# EAGLE design hitter (EAGLE 9.6.2)
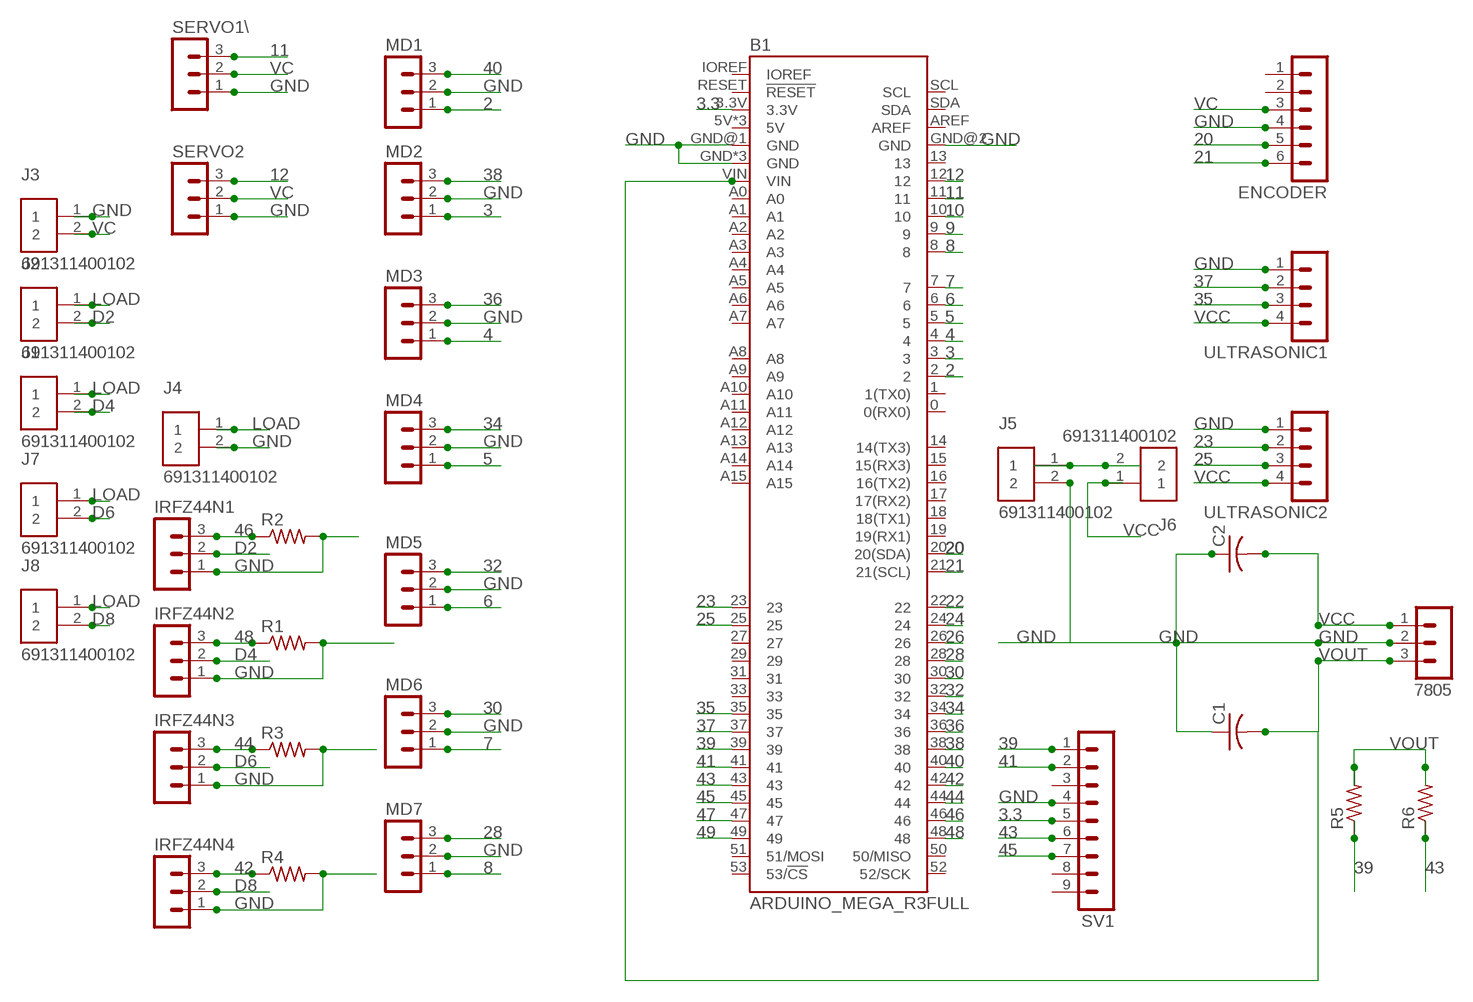
[diagram p0: schematic, sheet 1]

## Parts
7805  MA03-1  [MA03-1]
B1  ARDUINO_MEGA_R3FULL  [ARDUINO_MEGA_NO_SILK]
C1  C-US025-025X050  [C025-025X050]
C2  C-US025-025X050  [C025-025X050]
ENCODER  MA06-1  [MA06-1]
IRFZ44N1  MA03-1  [MA03-1]
IRFZ44N2  MA03-1  [MA03-1]
IRFZ44N3  MA03-1  [MA03-1]
IRFZ44N4  MA03-1  [MA03-1]
J1  691311400102  [TERMINALBLOCK_PLUGGABLE-2-7.62MM]
J2  691311400102  [TERMINALBLOCK_PLUGGABLE-2-7.62MM]
J3  691311400102  [TERMINALBLOCK_PLUGGABLE-2-7.62MM]
J4  691311400102  [TERMINALBLOCK_PLUGGABLE-2-7.62MM]
J5  691311400102  [TERMINALBLOCK_PLUGGABLE-2-7.62MM]
J6  691311400102  [TERMINALBLOCK_PLUGGABLE-2-7.62MM]
J7  691311400102  [TERMINALBLOCK_PLUGGABLE-2-7.62MM]
J8  691311400102  [TERMINALBLOCK_PLUGGABLE-2-7.62MM]
MD1  MA03-1  [MA03-1]
MD2  MA03-1  [MA03-1]
MD3  MA03-1  [MA03-1]
MD4  MA03-1  [MA03-1]
MD5  MA03-1  [MA03-1]
MD6  MA03-1  [MA03-1]
MD7  MA03-1  [MA03-1]
R1  R-US_0204/5  [0204/5]
R2  R-US_0204/5  [0204/5]
R3  R-US_0204/5  [0204/5]
R4  R-US_0204/5  [0204/5]
R5  R-US_0204/5  [0204/5]
R6  R-US_0204/5  [0204/5]
SERVO1\  MA03-1  [MA03-1]
SERVO2  MA03-1  [MA03-1]
SV1  MA09-1  [MA09-1]
ULTRASONIC1  MA04-1  [MA04-1]
ULTRASONIC2  MA04-1  [MA04-1]

## Nets
2: B1.2 MD1.1
3: B1.3 MD2.1
3.3: B1.3.3V SV1.5
4: B1.4 MD3.1
5: B1.5 MD4.1
6: B1.6 MD5.1
7: B1.7 MD6.1
8: B1.8 MD7.1
9: B1.9
10: B1.10
11: B1.11 SERVO1\.3
12: B1.12 SERVO2.3
20: B1.20(20(SDA)) ENCODER.5
21: B1.21(21(SCL)) ENCODER.6
22: B1.22
23: B1.23 ULTRASONIC2.2
24: B1.24
25: B1.25 ULTRASONIC2.3
26: B1.26
28: B1.28 MD7.3
30: B1.30 MD6.3
32: B1.32 MD5.3
34: B1.34 MD4.3
35: B1.35 ULTRASONIC1.3
36: B1.36 MD3.3
37: B1.37 ULTRASONIC1.2
38: B1.38 MD2.3
39: B1.39 R5.1 SV1.1
40: B1.40 MD1.3
41: B1.41 SV1.2
42: B1.42 IRFZ44N4.3 R4.1
43: B1.43 R6.1 SV1.6
44: B1.44 IRFZ44N3.3 R3.1
45: B1.45 SV1.7
46: B1.46 IRFZ44N1.3 R2.1
47: B1.47
48: B1.48 IRFZ44N2.3 R1.1
49: B1.49
D2: IRFZ44N1.2 J2.2
D4: IRFZ44N2.2 J1.2
D6: IRFZ44N3.2 J7.2
D8: IRFZ44N4.2 J8.2
GND: 7805.2 B1.GND B1.GND@1(GND) B1.GND@2(GND) B1.GND@3(GND) B1.GND@4(GND) C1.1 C2.1 ENCODER.4 IRFZ44N1.1 IRFZ44N2.1 IRFZ44N3.1 IRFZ44N4.1 J3.1 J4.2 J5.2 MD1.2 MD2.2 MD3.2 MD4.2 MD5.2 MD6.2 MD7.2 R1.2 R2.2 R3.2 R4.2 SERVO1\.1 SERVO2.1 SV1.4 ULTRASONIC1.1 ULTRASONIC2.1
LOAD: J1.1 J2.1 J4.1 J7.1 J8.1
N$1: J5.1 J6.2
VC: ENCODER.3 J3.2 SERVO1\.2 SERVO2.2
VCC: 7805.1 C2.2 J6.1 ULTRASONIC1.4 ULTRASONIC2.4
VOUT: 7805.3 B1.VIN C1.2 R5.2 R6.2
Unconnected: B1.0(0(RX0)) B1.1(1(TX0)) B1.5V B1.5V@1(5V) B1.5V@2(5V) B1.13 B1.14(14(TX3)) B1.15(15(RX3)) B1.16(16(TX2)) B1.17(17(RX2)) B1.18(18(TX1)) B1.19(19(RX1)) B1.27 B1.29 B1.31 B1.33 B1.50(50/MISO) B1.51(51/MOSI) B1.52(52/SCK) B1.53(53/!CS) B1.A0 B1.A1 B1.A2 B1.A3 B1.A4 B1.A5 B1.A6 B1.A7 B1.A8 B1.A9 B1.A10 B1.A11 B1.A12 B1.A13 B1.A14 B1.A15 B1.AREF B1.IOREF B1.RESET(!RESET) B1.SCL B1.SDA ENCODER.1 ENCODER.2 SV1.3 SV1.8 SV1.9

## Library data of the parts
7805 IRFZ44N1-IRFZ44N4 MD1-MD7 SERVO1\ SERVO2 = con-lstb:MA03-1: PIN HEADER; OC_FARNELL: unknown; OC_NEWARK: unknown
B1 = SparkFun-Boards:ARDUINO_MEGA_R3: Arduino Mega R3 ATmega2560 R3 compatible footprint. SparkFun Products: Arduino Mega 2560 R3 <https://www.sparkfun.com/products/11061>
C1 C2 = resistor:C-US: CAPACITOR, American symbol
ENCODER = con-lstb:MA06-1: PIN HEADER; OC_FARNELL: unknown; OC_NEWARK: unknown
J1-J8 = Terminal Blocks FOR USE IN PB:691311400102: 7.62MM CLOSE VERTICAL PCB HEADER WR-TBL Manufacturer's datasheet <https://katalog.we-online.com/em/datasheet/6913114001xx.pdf>; CREATED_BY: PCBLayout.com; DIGIKEY_PART_NO: 732-2823-ND; MANUFACTURER: WURTH ELEKTRONIK; MPN: 691311400102
R1-R6 = resistor:R-US_: RESISTOR, American symbol
SV1 = con-lstb:MA09-1: PIN HEADER; OC_FARNELL: unknown; OC_NEWARK: unknown
ULTRASONIC1 ULTRASONIC2 = con-lstb:MA04-1: PIN HEADER; OC_FARNELL: unknown; OC_NEWARK: unknown

## Board
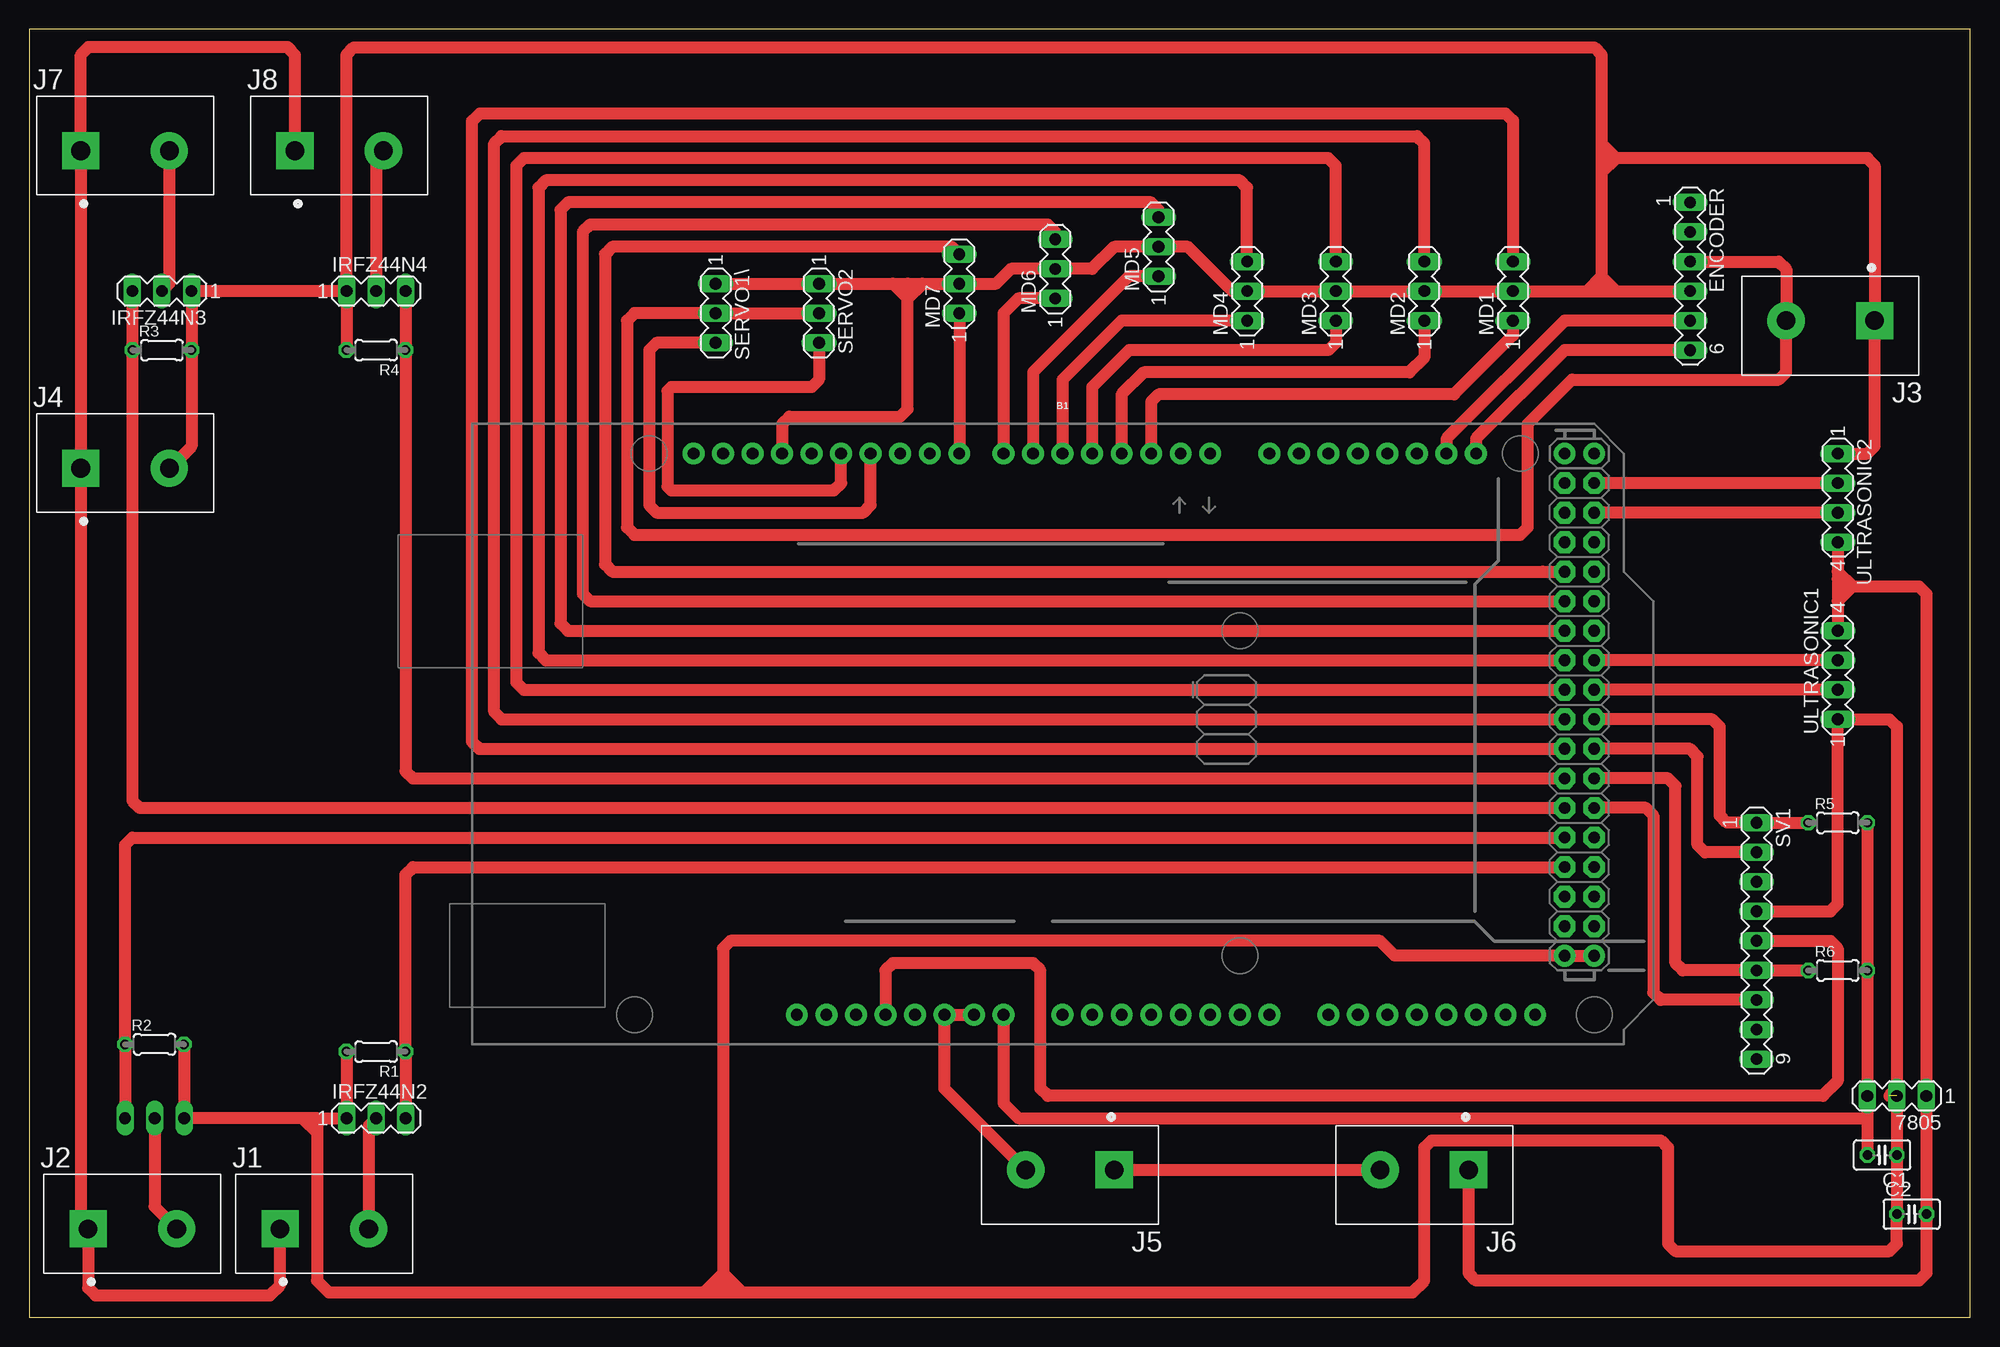
[diagram p1: board, top side]
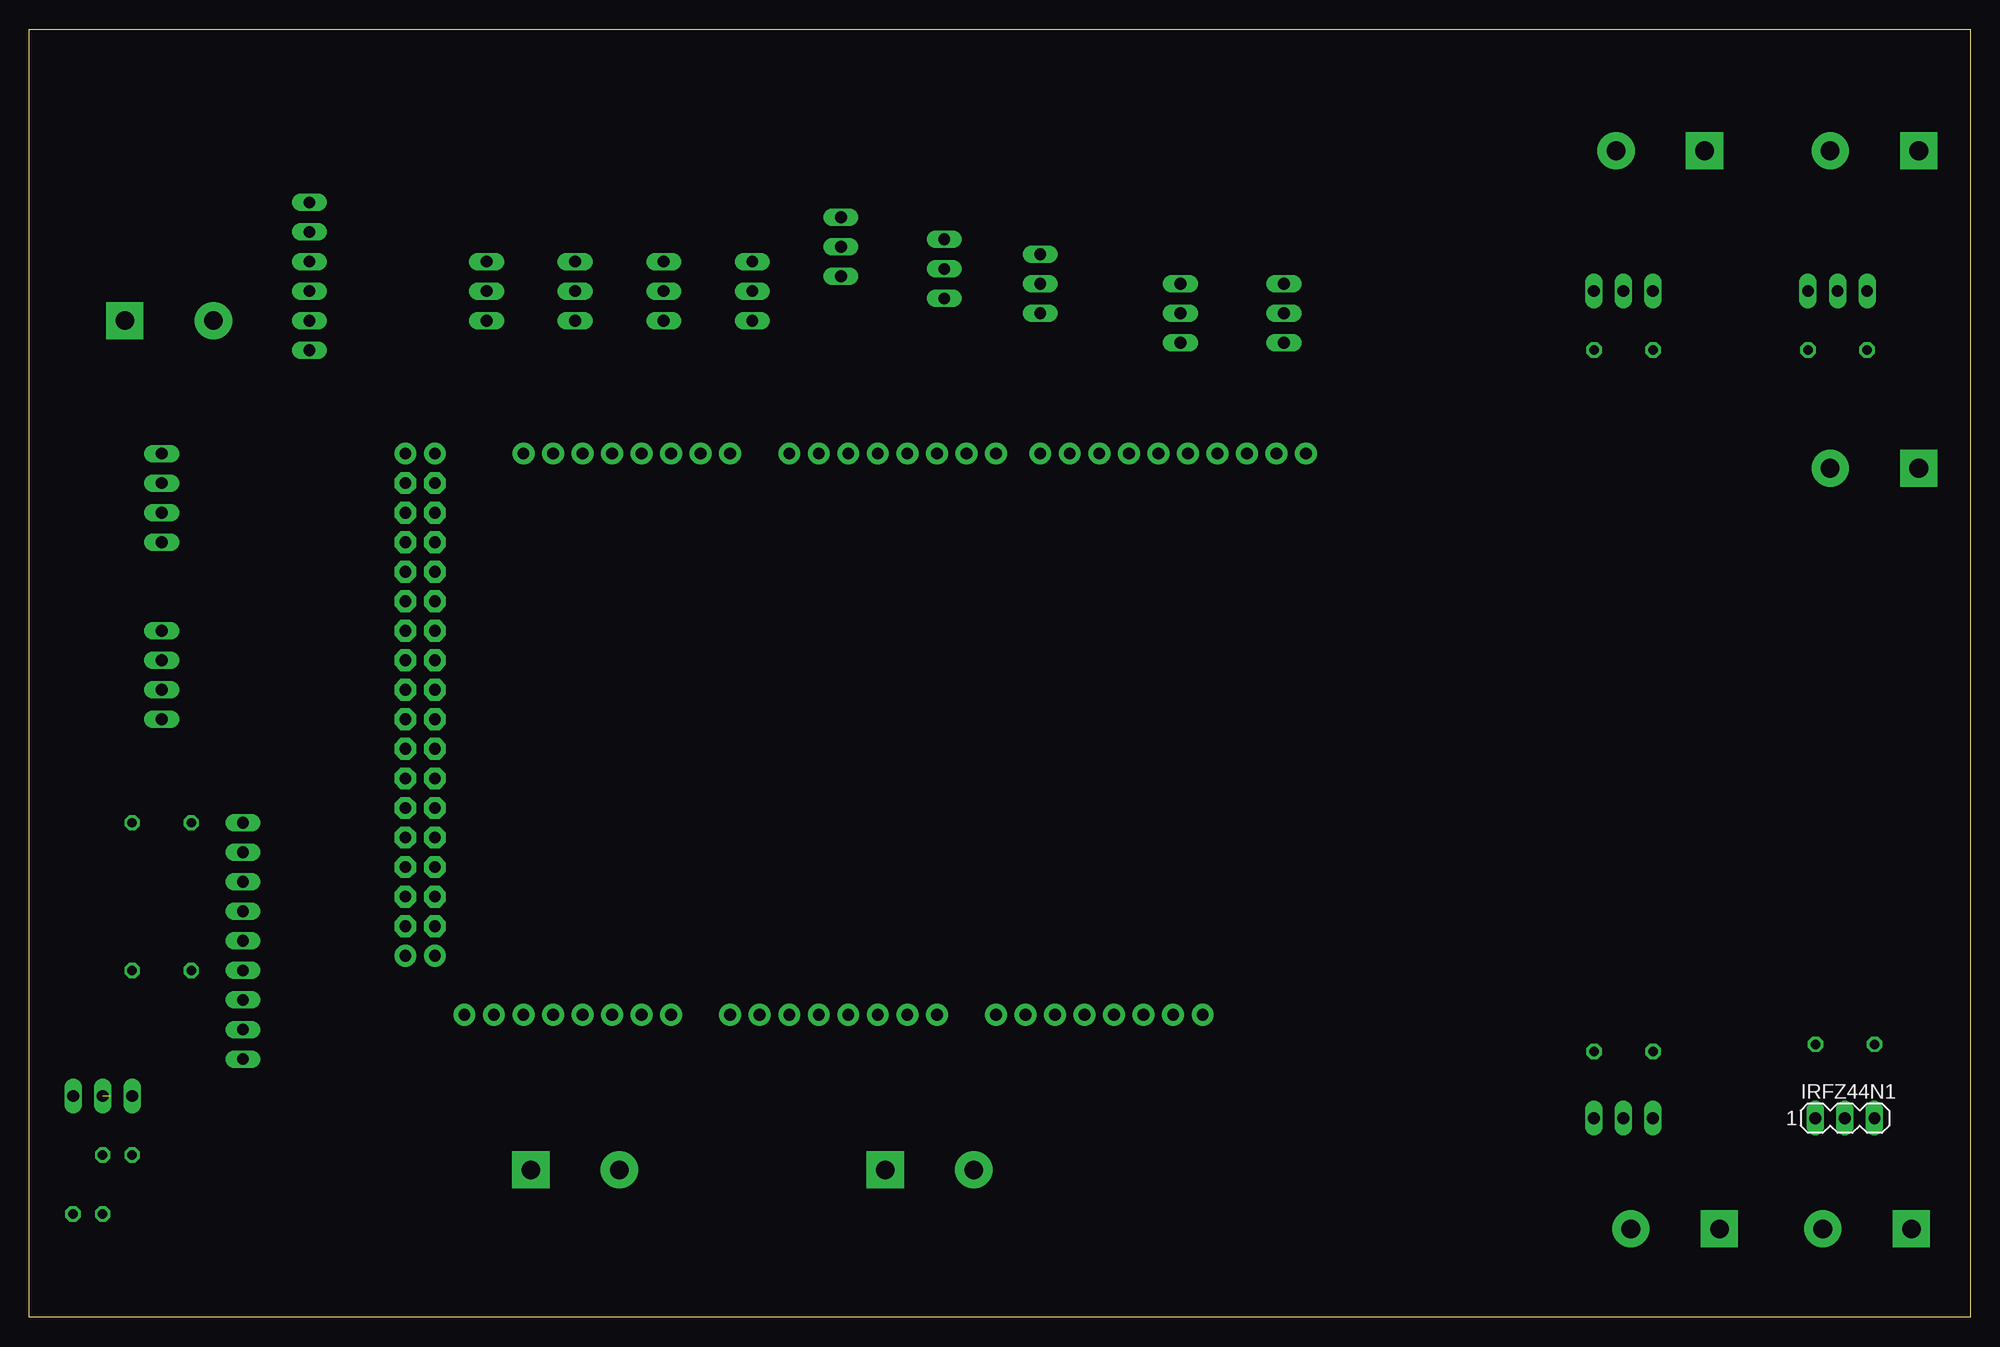
[diagram p2: board, bottom side, seen from below]

Size 166.99 x 110.8 mm. Coordinates in mm from the lower left corner, seen from the top.
Outline: 0,0 166.99,0 166.99,110.8 0,110.8 0,0
Copper layers (1*16): Top 0.035mm / dielectric 1.5mm / Bottom 0.035mm
Design rules "default": minimum track width 6mil, minimum drill 0.35mm, track to track 6mil, track to pad 6mil, pad to pad 6mil, via to via 6mil, smd to smd 6mil, copper to edge 40mil, drill to drill 6mil, minimum pad ring 10mil, minimum via ring 8mil, stop-mask expansion 4mil, vias tented up to drill 0mil, thermal gap 10mil

### Footprints (pad centres in the part's own frame; a part is rotated, then mirrored left to right if it is on the bottom)
MA03-1 = drill 1.016 long: 1 -2.54,0; 2 0,0; 3 2.54,0
ARDUINO_MEGA_NO_SILK = drill 1.016 pad 1.88: 0 13.97,24.13; 1 11.43,24.13; 2 8.89,24.13; 3 6.35,24.13; 3.3V -13.97,-24.13; 4 3.81,24.13; 5 1.27,24.13; 5V -11.43,-24.13; 5V@1 44.45,24.13; 5V@2 46.99,24.13; 6 -1.27,24.13; 7 -3.81,24.13; 8 -7.62,24.13; 9 -10.16,24.13; 10 -12.7,24.13; 11 -15.24,24.13; 12 -17.78,24.13; 13 -20.32,24.13; 14 19.05,24.13; 15 21.59,24.13; 16 24.13,24.13; 17 26.67,24.13; 18 29.21,24.13; 19 31.75,24.13; 20 34.29,24.13; 21 36.83,24.13; A0 1.27,-24.13; A1 3.81,-24.13; A2 6.35,-24.13; A3 8.89,-24.13; A4 11.43,-24.13; A5 13.97,-24.13; A6 16.51,-24.13; A7 19.05,-24.13; A8 24.13,-24.13; A9 26.67,-24.13; A10 29.21,-24.13; A11 31.75,-24.13; A12 34.29,-24.13; A13 36.83,-24.13; A14 39.37,-24.13; A15 41.91,-24.13; AREF -25.4,24.13; GND -8.89,-24.13; GND@1 -6.35,-24.13; GND@2 44.45,-19.05; GND@3 46.99,-19.05; GND@4 -22.86,24.13; IOREF -19.05,-24.13; NC -21.59,-24.13; RESET -16.51,-24.13; SCL -30.48,24.13; SDA -27.94,24.13; VIN -3.81,-24.13 | drill 1.016 pad 1.88 octagon: 22 44.45,21.59; 23 46.99,21.59; 24 44.45,19.05; 25 46.99,19.05; 26 44.45,16.51; 27 46.99,16.51; 28 44.45,13.97; 29 46.99,13.97; 30 44.45,11.43; 31 46.99,11.43; 32 44.45,8.89; 33 46.99,8.89; 34 44.45,6.35; 35 46.99,6.35; 36 44.45,3.81; 37 46.99,3.81; 38 44.45,1.27; 39 46.99,1.27; 40 44.45,-1.27; 41 46.99,-1.27; 42 44.45,-3.81; 43 46.99,-3.81; 44 44.45,-6.35; 45 46.99,-6.35; 46 44.45,-8.89; 47 46.99,-8.89; 48 44.45,-11.43; 49 46.99,-11.43; 50 44.45,-13.97; 51 46.99,-13.97; 52 44.45,-16.51; 53 46.99,-16.51
C025-025X050 = drill 0.813 octagon: 1 -1.27,0; 2 1.27,0
MA06-1 = drill 1.016 long: 1 -6.35,0; 2 -3.81,0; 3 -1.27,0; 4 1.27,0; 5 3.81,0; 6 6.35,0
TERMINALBLOCK_PLUGGABLE-2-7.62MM = drill 1.6 pad 3.2 square: 1 -3.81,0 | drill 1.6 pad 3.2: 2 3.81,0
0204/5 = drill 0.813 octagon: 1 -2.54,0; 2 2.54,0
MA09-1 = drill 1.016 long: 1 -10.16,0; 2 -7.62,0; 3 -5.08,0; 4 -2.54,0; 5 0,0; 6 2.54,0; 7 5.08,0; 8 7.62,0; 9 10.16,0
MA04-1 = drill 1.016 long: 1 -3.81,0; 2 -1.27,0; 3 1.27,0; 4 3.81,0

### Placement (x,y rotation side)
7805  160.66,19.05 180 top
B1  87.63,50.16 0 top
C1  159.38,13.97 180 top
C2  161.93,8.89 0 top
ENCODER  142.88,89.54 270 top
IRFZ44N1  10.79,17.15 0 bottom
IRFZ44N2  29.85,17.15 0 top
IRFZ44N3  11.43,88.27 180 top
IRFZ44N4  29.85,88.27 0 top
J1  25.4,7.62 0 top
J2  8.89,7.62 0 top
J3  154.94,85.73 180 top
J4  8.25,73.03 0 top
J5  89.53,12.7 180 top
J6  120.02,12.7 180 top
J7  8.25,100.33 0 top
J8  26.67,100.33 0 top
MD1  127.63,88.27 90 top
MD2  120.02,88.27 90 top
MD3  112.4,88.27 90 top
MD4  104.78,88.27 90 top
MD5  97.16,92.08 90 top
MD6  88.27,90.17 90 top
MD7  80.01,88.9 90 top
R1  29.85,22.86 180 top
R2  10.79,23.5 0 top
R3  11.43,83.19 0 top
R4  29.85,83.19 180 top
R5  155.58,42.54 0 top
R6  155.58,29.85 0 top
SERVO1\  59.06,86.36 270 top
SERVO2  67.95,86.36 270 top
SV1  148.59,32.38 270 top
ULTRASONIC1  155.58,55.24 90 top
ULTRASONIC2  155.58,70.48 270 top

### Tracks (layer width: path | path; a pad name or v marks a point on that pad's centre or on a via)
2
  Top 1.016: B1.2 96.52,78.74 97.16,79.38 122.56,79.38 127.63,84.45 MD1.1
3
  Top 1.016: MD2.1 120.02,82.55 118.75,81.28 95.89,81.28 93.98,79.38 B1.3
3.3
  Top 1.016: SV1.5 154.94,32.38 155.58,31.75 155.58,20.32 154.31,19.05 87.63,19.05 87,19.69 87,29.85 86.36,30.48 74.3,30.48 73.66,29.85 B1.3.3V
4
  Top 1.016: MD3.1 112.4,83.82 111.76,83.19 94.62,83.19 91.44,80.01 B1.4
5
  Top 1.016: MD4.1 93.98,85.73 88.9,80.65 B1.5
6
  Top 1.016: MD5.1 94.62,89.54 86.36,81.28 B1.6
7
  Top 1.016: MD6.1 85.09,87.63 83.82,86.36 B1.7
8
  Top 1.016: MD7.1 B1.8
11
  Top 1.016: SERVO1\.3 53.98,83.82 53.34,83.19 53.34,69.85 53.98,69.22 71.76,69.22 72.39,69.85 B1.11
12
  Top 1.016: SERVO2.3 67.95,80.65 67.31,80.01 55.25,80.01 54.92,79.68 54.92,71.45 55.25,71.12 69.22,71.12 69.85,71.76 B1.12
20
  Top 1.016: ENCODER.5 132.08,85.73 121.92,75.57 B1.20
21
  Top 1.016: ENCODER.6 132.08,83.19 124.46,75.57 B1.21
23
  Top 1.016: ULTRASONIC2.2 B1.23
25
  Top 1.016: ULTRASONIC2.3 B1.25
28
  Top 1.016: MD7.3 79.38,92.08 50.17,92.08 49.53,91.44 49.53,64.77 50.17,64.14 130.18,64.14 130.81,64.14 B1.28
30
  Top 1.016: MD6.3 88.27,93.34 87.63,93.98 48.26,93.98 47.62,93.34 47.62,62.23 48.26,61.59 B1.30
32
  Top 1.016: MD5.3 97.16,95.25 96.52,95.89 46.36,95.89 45.72,95.25 45.72,59.69 46.36,59.05 B1.32
34
  Top 1.016: MD4.3 104.78,97.16 104.14,97.79 44.45,97.79 43.81,97.16 43.81,57.15 44.45,56.52 B1.34
35
  Top 1.016: ULTRASONIC1.3 B1.35
36
  Top 1.016: MD3.3 112.4,99.06 111.76,99.7 42.55,99.7 41.91,99.06 41.91,54.61 42.55,53.98 B1.36
37
  Top 1.016: ULTRASONIC1.2 B1.37
38
  Top 1.016: MD2.3 120.02,100.97 119.38,101.6 40.64,101.6 40,100.97 40,52.07 40.64,51.43 B1.38
39
  Top 1.016: B1.39 144.78,51.43 145.41,50.8 145.41,43.18 146.05,42.54 SV1.1 R5.1
40
  Top 1.016: MD1.3 127.63,102.92 127,103.56 38.79,103.56 38.1,102.87 38.1,49.53 38.73,48.89 B1.40
41
  Top 1.016: SV1.2 144.15,40 143.51,40.64 143.51,48.26 142.88,48.89 B1.41
42
  Top 1.016: B1.42 33.02,46.35 32.39,46.99 R4.1 IRFZ44N4.3
43
  Top 1.016: B1.43 140.97,46.35 141.6,45.72 141.6,30.48 142.24,29.85 SV1.6 R6.1
44
  Top 1.016: IRFZ44N3.3 R3.1 8.89,44.45 9.52,43.81 B1.44
45
  Top 1.016: SV1.7 140.34,27.31 139.7,27.94 139.7,43.18 139.06,43.81 B1.45
46
  Top 1.016: IRFZ44N1.3 R2.1 8.25,40.64 8.89,41.27 B1.46
48
  Top 1.016: IRFZ44N2.3 R1.1 32.39,38.1 33.02,38.73 B1.48
D2
  Top 1.016: IRFZ44N1.2 10.79,9.53 J2.2
D4
  Top 1.016: IRFZ44N2.2 29.21,16.51 J1.2
D6
  Top 1.016: J7.2 12.07,88.9 IRFZ44N3.2
D8
  Top 1.016: J8.2 29.85,99.7 IRFZ44N4.2
GND  (1 unrouted)
  Top 1.016: B1.GND@4 64.77,76.84 65.41,77.47 74.93,77.47 75.56,78.11 75.56,88.9 | 133.99,88.27 MD1.2 MD2.2 MD3.2 MD4.2 103.51,88.27 99.7,92.08 MD5.2 93.34,92.08 91.44,90.17 MD6.2 84.45,90.17 83.19,88.9 MD7.2 76.84,88.9 | 133.99,88.27 135.25,88.27 | 135.25,88.27 136.53,88.27 | 136.53,88.27 ENCODER.4 | SERVO1\.1 SERVO2.1 74.3,88.9 | 74.3,88.9 75.56,88.9 | 75.56,88.9 76.84,88.9 | 76.84,88.9 75.56,87.63 74.3,88.9 | 135.25,88.27 135.25,89.54 | 135.25,89.54 133.99,88.27 | 135.25,89.54 136.53,88.27 | ULTRASONIC2.1 158.12,74.3 158.75,74.93 J3.1 158.75,99.06 158.12,99.7 136.53,99.7 | IRFZ44N4.1 IRFZ44N3.1 R3.2 13.97,74.93 J4.2 | IRFZ44N4.1 27.31,108.59 27.94,109.22 134.62,109.22 135.25,108.59 135.25,100.97 | 135.25,100.97 135.25,99.7 | 135.25,99.7 135.25,98.43 | 135.25,98.43 135.25,89.54 | 136.53,99.7 135.25,99.7 | 135.25,100.97 136.53,99.7 | 136.53,99.7 135.25,98.43 | 24.76,17.15 23.5,17.15 | 23.5,17.15 IRFZ44N1.1 R2.2 | 24.76,17.15 IRFZ44N2.1 R1.2 | IRFZ44N4.1 R4.2 | SV1.4 154.94,34.92 155.58,35.56 ULTRASONIC1.1 160.02,51.43 160.66,50.8 160.66,19.69 160.02,19.05 | B1.GND@1 B1.GND 78.74,19.69 J5.2 | 58.04,2.16 59.69,2.16 | 59.69,2.16 61.34,2.16 | B1.GND@3 B1.GND@2 117.48,31.12 116.2,32.38 60.33,32.38 59.69,31.75 59.69,3.81 | 61.34,2.16 119,2.16 120.02,3.17 120.02,14.61 120.65,15.24 140.34,15.24 140.97,14.61 140.97,6.35 141.6,5.71 160.02,5.71 160.66,6.35 C2.1 C1.1 7805.2 | 59.69,3.81 59.69,2.16 | 58.04,2.16 59.69,3.81 | 61.34,2.16 59.69,3.81 | 24.76,17.15 24.76,15.88 | 24.76,15.88 24.76,3.17 25.78,2.16 58.04,2.16 | 24.76,15.88 23.5,17.15
LOAD
  Top 1.016: 22.22,109.22 22.54,108.9 | 22.54,108.9 22.86,108.59 J8.1 | J1.1 21.59,2.79 20.7,1.91 5.71,1.91 5.08,2.54 J2.1 4.45,8.26 J4.1 J7.1 4.45,108.59 5.13,109.27 22.22,109.27 22.54,108.95 22.54,108.9
N$1
  Top 1.016: J5.1 J6.2
VC
  Top 1.016: ENCODER.3 150.5,90.81 151.13,90.17 J3.2 151.13,81.28 150.5,80.65 132.72,80.65 128.91,76.84 128.91,67.95 128.27,67.31 52.07,67.31 51.44,67.95 51.44,85.73 52.07,86.36 SERVO1\.2 SERVO2.2
VCC
  Top 1.016: ULTRASONIC2.4 155.58,64.14 | 155.58,64.14 155.58,63.5 | 155.58,63.5 155.58,61.59 | 155.58,61.59 ULTRASONIC1.4 | 155.58,63.5 156.21,62.86 156.84,62.86 | 156.84,62.86 162.56,62.86 163.19,62.23 7805.1 C2.2 163.19,3.81 162.56,3.17 124.46,3.17 123.83,3.81 J6.1 | 155.58,64.14 156.84,62.86 | 156.84,62.86 155.58,61.59
VOUT
  Top 1.016: R5.2 R6.2 7805.3 158.12,17.15 | 158.12,17.15 C1.2 | B1.VIN 83.82,18.42 85.09,17.15 158.12,17.15